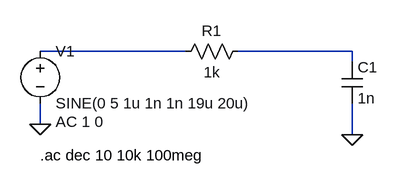
[diagram p0: schematic quiz_q6.asc]
quiz_q6.asc, the LTspice schematic file:
Version 4
SHEET 1 880 680
WIRE 352 80 128 80
WIRE 608 80 432 80
WIRE 608 96 608 80
WIRE 128 192 128 160
WIRE 608 208 608 160
FLAG 128 192 0
FLAG 608 208 0
SYMBOL voltage 128 64 R0
WINDOW 123 24 124 Left 2
WINDOW 39 0 0 Left 0
SYMATTR InstName V1
SYMATTR Value SINE(0 5 1u 1n 1n 19u 20u)
SYMATTR Value2 AC 1 0
SYMBOL res 448 64 R90
WINDOW 0 0 56 VBottom 2
WINDOW 3 32 56 VTop 2
SYMATTR InstName R1
SYMATTR Value 1k
SYMBOL cap 592 96 R0
SYMATTR InstName C1
SYMATTR Value 1n
TEXT 128 240 Left 2 !.ac dec 10 10k 100meg

The netlist it stands for:
* quiz_q6.asc
V1 N001 0 SINE(0 5 1u 1n 1n 19u 20u) AC 1 0
R1 N002 N001 1k
C1 N002 0 1n
.ac dec 10 10k 100meg
.backanno
.end